# EAGLE design pqfb100-breakout (EAGLE 6.6.0)
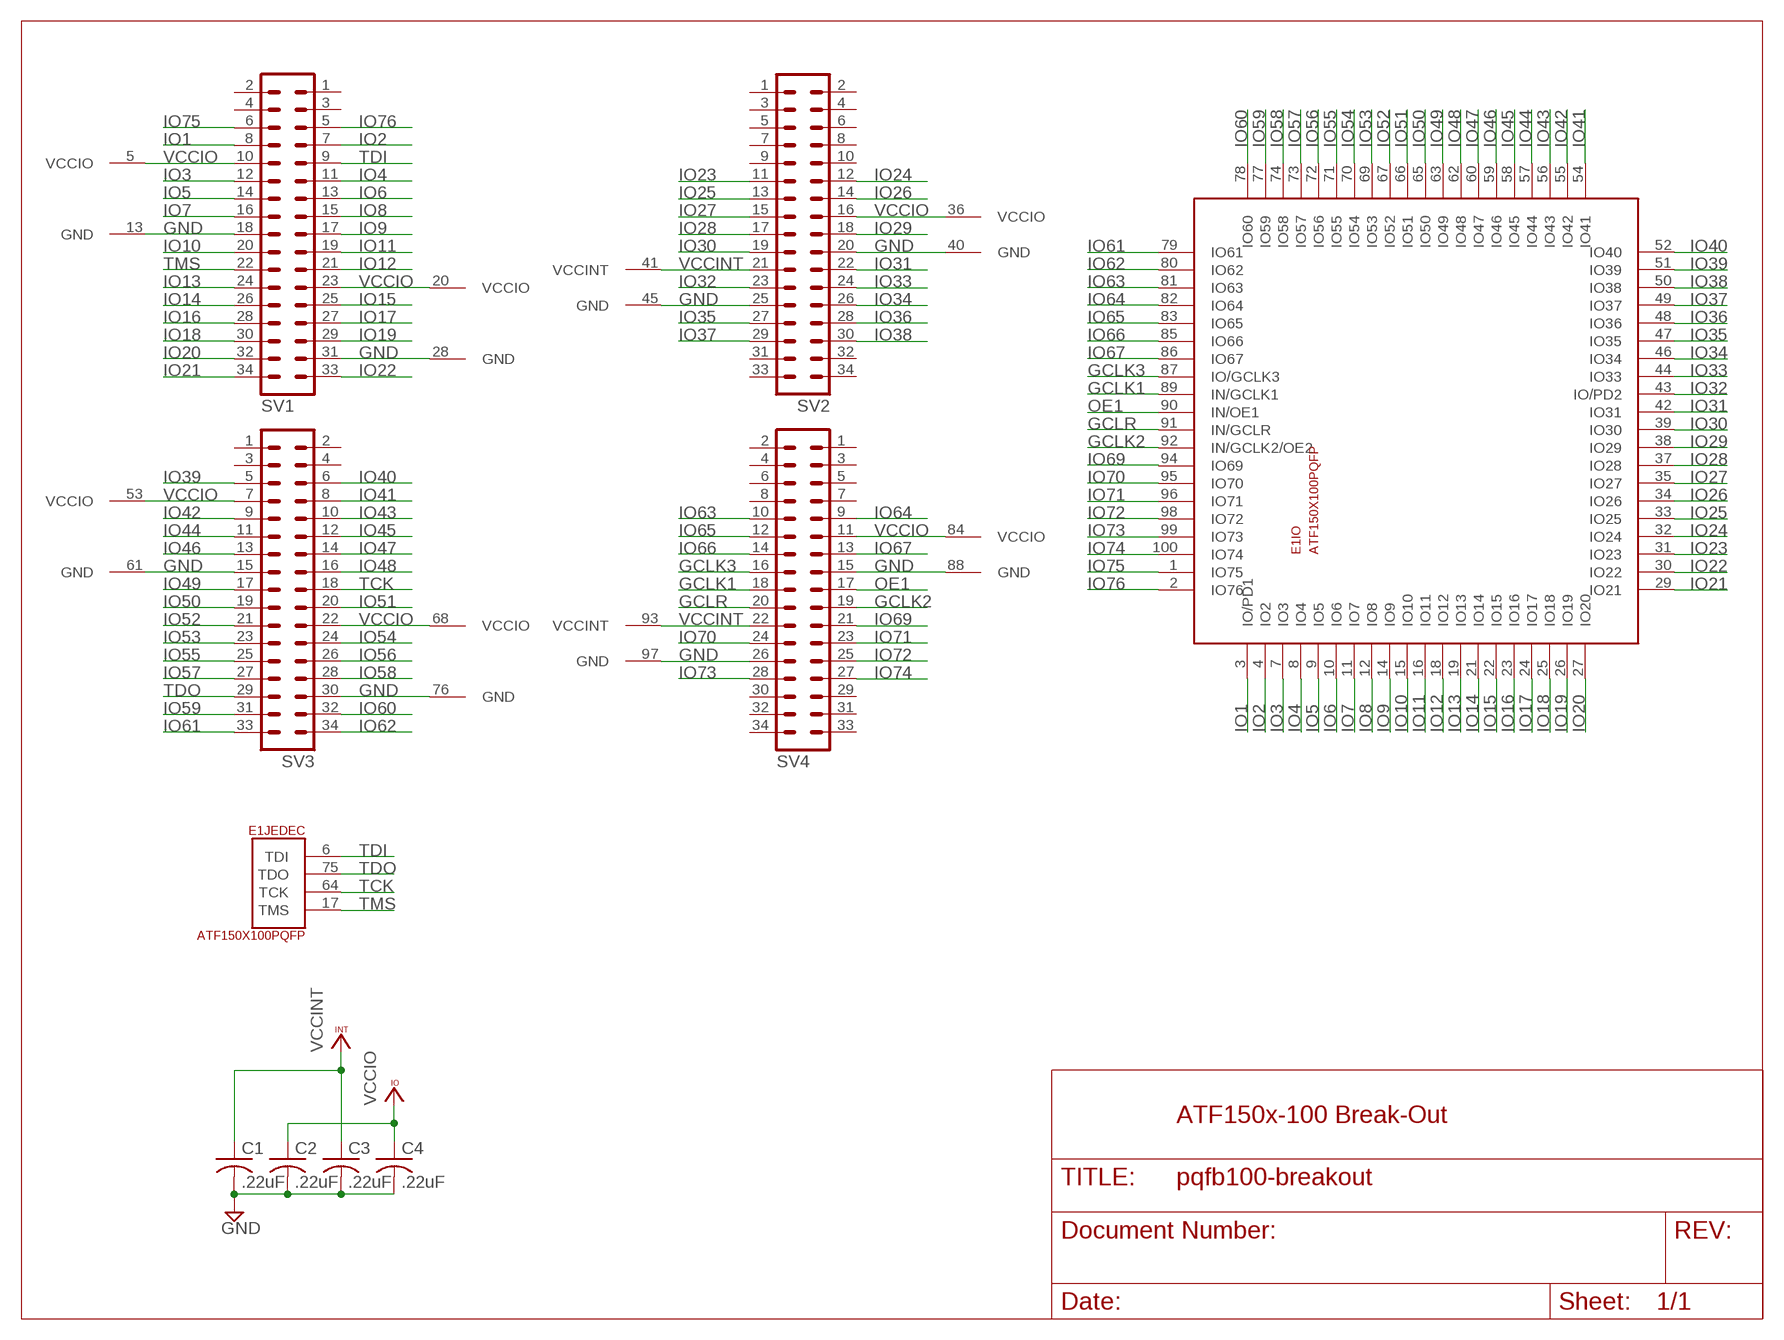
[diagram p0: schematic, sheet 1]

## Parts
C1  .22uF  C-US  [C063-025X075]
C2  .22uF  C-US  [C063-025X075]
C3  .22uF  C-US  [C063-025X075]
C4  .22uF  C-US  [C063-025X075]
E1  ATF150X100PQFP  [PQFP-100]
SV1  MA17-2  [MA17-2]
SV2  MA17-2  [MA17-2]
SV3  MA17-2  [MA17-2]
SV4  MA17-2  [MA17-2]

## Nets
GCLK1: E1.89(IO:IN/GCLK1) SV4.18
GCLK2: E1.92(IO:IN/GCLK2/OE2) SV4.19
GCLK3: E1.87(IO:IO/GCLK3) SV4.16
GCLR: E1.91(IO:IN/GCLR) SV4.20
GND [supply]: C1.2 C2.2 C3.2 C4.2 E1.13(GND) E1.28(GND) E1.40(GND) E1.45(GND) E1.61(GND) E1.76(GND) E1.88(GND) E1.97(GND) SV1.18 SV1.31 SV2.20 SV2.25 SV3.15 SV3.30 SV4.15 SV4.26
IO1: E1.3(IO:IO/PD1) SV1.8
IO2: E1.4(IO:IO2) SV1.7
IO3: E1.7(IO:IO3) SV1.12
IO4: E1.8(IO:IO4) SV1.11
IO5: E1.9(IO:IO5) SV1.14
IO6: E1.10(IO:IO6) SV1.13
IO7: E1.11(IO:IO7) SV1.16
IO8: E1.12(IO:IO8) SV1.15
IO9: E1.14(IO:IO9) SV1.17
IO10: E1.15(IO:IO10) SV1.20
IO11: E1.16(IO:IO11) SV1.19
IO12: E1.18(IO:IO12) SV1.21
IO13: E1.19(IO:IO13) SV1.24
IO14: E1.21(IO:IO14) SV1.26
IO15: E1.22(IO:IO15) SV1.25
IO16: E1.23(IO:IO16) SV1.28
IO17: E1.24(IO:IO17) SV1.27
IO18: E1.25(IO:IO18) SV1.30
IO19: E1.26(IO:IO19) SV1.29
IO20: E1.27(IO:IO20) SV1.32
IO21: E1.29(IO:IO21) SV1.34
IO22: E1.30(IO:IO22) SV1.33
IO23: E1.31(IO:IO23) SV2.11
IO24: E1.32(IO:IO24) SV2.12
IO25: E1.33(IO:IO25) SV2.13
IO26: E1.34(IO:IO26) SV2.14
IO27: E1.35(IO:IO27) SV2.15
IO28: E1.37(IO:IO28) SV2.17
IO29: E1.38(IO:IO29) SV2.18
IO30: E1.39(IO:IO30) SV2.19
IO31: E1.42(IO:IO31) SV2.22
IO32: E1.43(IO:IO/PD2) SV2.23
IO33: E1.44(IO:IO33) SV2.24
IO34: E1.46(IO:IO34) SV2.26
IO35: E1.47(IO:IO35) SV2.27
IO36: E1.48(IO:IO36) SV2.28
IO37: E1.49(IO:IO37) SV2.29
IO38: E1.50(IO:IO38) SV2.30
IO39: E1.51(IO:IO39) SV3.5
IO40: E1.52(IO:IO40) SV3.6
IO41: E1.54(IO:IO41) SV3.8
IO42: E1.55(IO:IO42) SV3.9
IO43: E1.56(IO:IO43) SV3.10
IO44: E1.57(IO:IO44) SV3.11
IO45: E1.58(IO:IO45) SV3.12
IO46: E1.59(IO:IO46) SV3.13
IO47: E1.60(IO:IO47) SV3.14
IO48: E1.62(IO:IO48) SV3.16
IO49: E1.63(IO:IO49) SV3.17
IO50: E1.65(IO:IO50) SV3.19
IO51: E1.66(IO:IO51) SV3.20
IO52: E1.67(IO:IO52) SV3.21
IO53: E1.69(IO:IO53) SV3.23
IO54: E1.70(IO:IO54) SV3.24
IO55: E1.71(IO:IO55) SV3.25
IO56: E1.72(IO:IO56) SV3.26
IO57: E1.73(IO:IO57) SV3.27
IO58: E1.74(IO:IO58) SV3.28
IO59: E1.77(IO:IO59) SV3.31
IO60: E1.78(IO:IO60) SV3.32
IO61: E1.79(IO:IO61) SV3.33
IO62: E1.80(IO:IO62) SV3.34
IO63: E1.81(IO:IO63) SV4.10
IO64: E1.82(IO:IO64) SV4.9
IO65: E1.83(IO:IO65) SV4.12
IO66: E1.85(IO:IO66) SV4.14
IO67: E1.86(IO:IO67) SV4.13
IO69: E1.94(IO:IO69) SV4.21
IO70: E1.95(IO:IO70) SV4.24
IO71: E1.96(IO:IO71) SV4.23
IO72: E1.98(IO:IO72) SV4.25
IO73: E1.99(IO:IO73) SV4.28
IO74: E1.100(IO:IO74) SV4.27
IO75: E1.1(IO:IO75) SV1.6
IO76: E1.2(IO:IO76) SV1.5
OE1: E1.90(IO:IN/OE1) SV4.17
TCK: E1.64(JEDEC:TCK) SV3.18
TDI: E1.6(JEDEC:TDI) SV1.9
TDO: E1.75(JEDEC:TDO) SV3.29
TMS: E1.17(JEDEC:TMS) SV1.22
VCCINT: C1.1 C3.1 E1.41(VCCINT) E1.93(VCCINT) SV2.21 SV4.22
VCCIO: C2.1 C4.1 E1.5(VCCIO) E1.20(VCCIO) E1.36(VCCIO) E1.53(VCCIO) E1.68(VCCIO) E1.84(VCCIO) SV1.10 SV1.23 SV2.16 SV3.7 SV3.22 SV4.11
Unconnected: SV1.1 SV1.2 SV1.3 SV1.4 SV2.1 SV2.2 SV2.3 SV2.4 SV2.5 SV2.6 SV2.7 SV2.8 SV2.9 SV2.10 SV2.31 SV2.32 SV2.33 SV2.34 SV3.1 SV3.2 SV3.3 SV3.4 SV4.1 SV4.2 SV4.3 SV4.4 SV4.5 SV4.6 SV4.7 SV4.8 SV4.29 SV4.30 SV4.31 SV4.32 SV4.33 SV4.34

## Notes on the sheet
- ATF150x-100 Break-Out

## Library data of the parts
C1-C4 = dec-con:C-US: Capacitors with funky DEC lead spacing.
E1 = atmel-cpld:ATF150X100: ATF150x in 100 pin package.
SV1-SV4 = con-lstb:MA17-2: PIN HEADER; OC_FARNELL: unknown; OC_NEWARK: unknown

## Net classes
0 default: width 0.381 mm
1 supply: width 0.381 mm

## Board
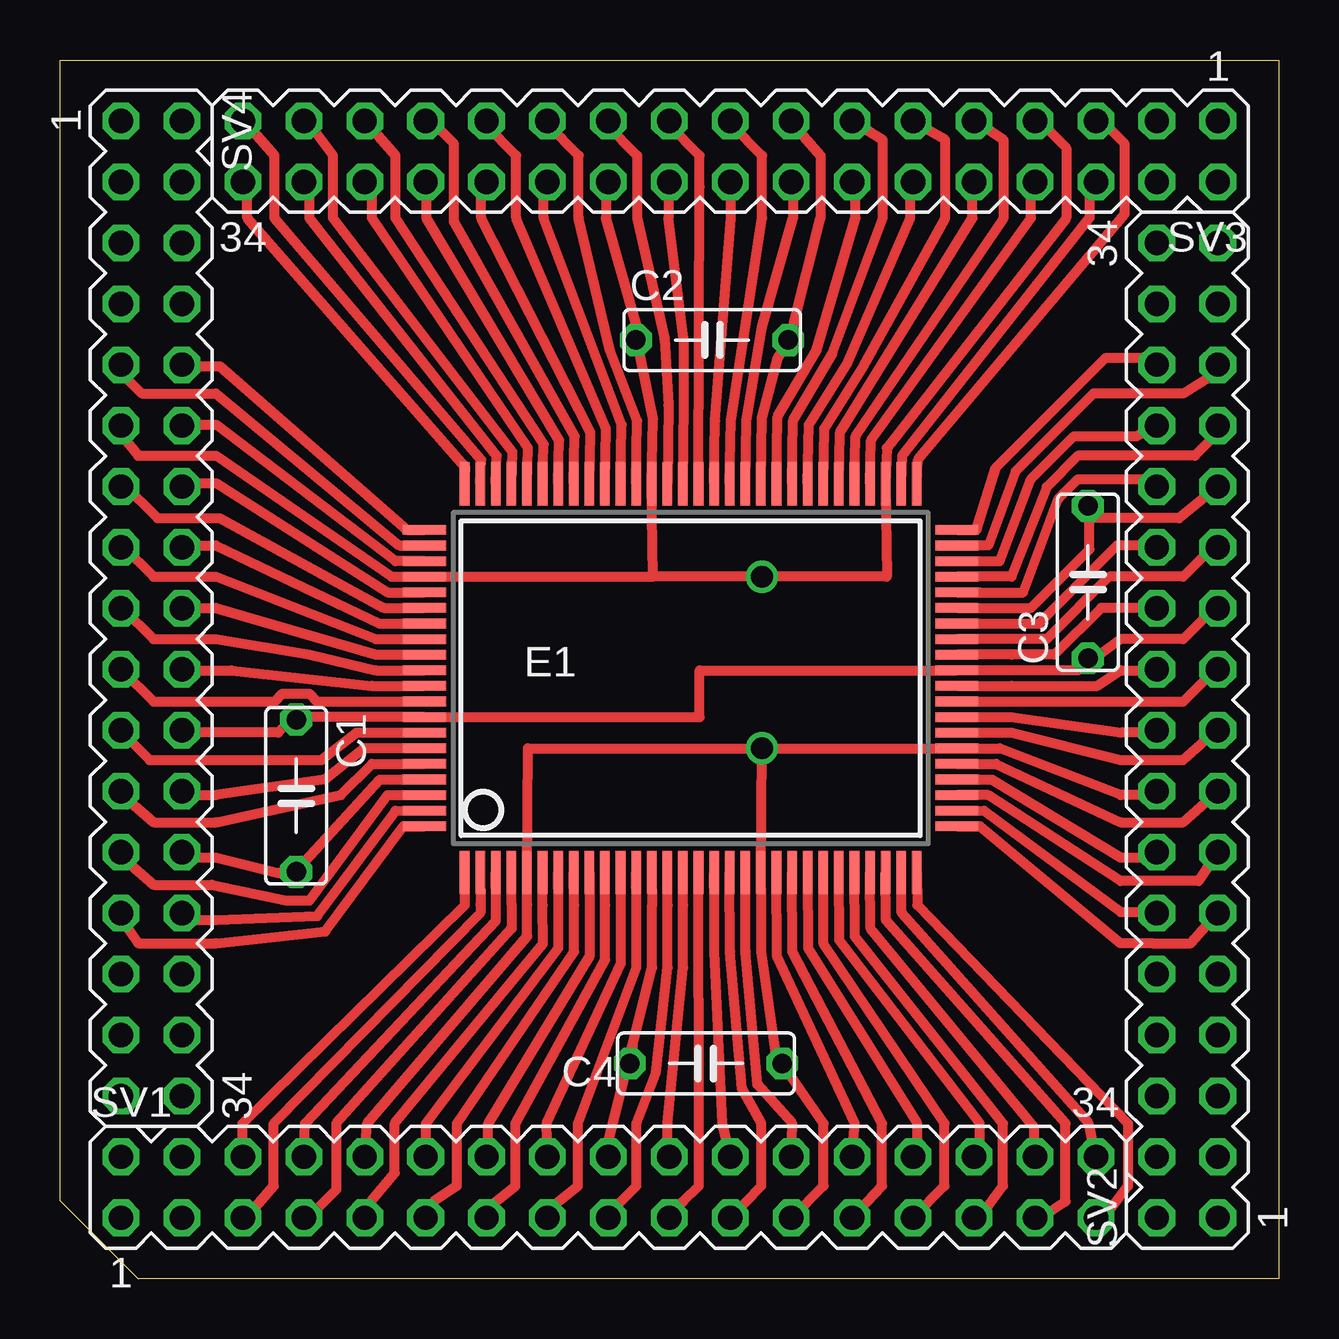
[diagram p1: board, top side]
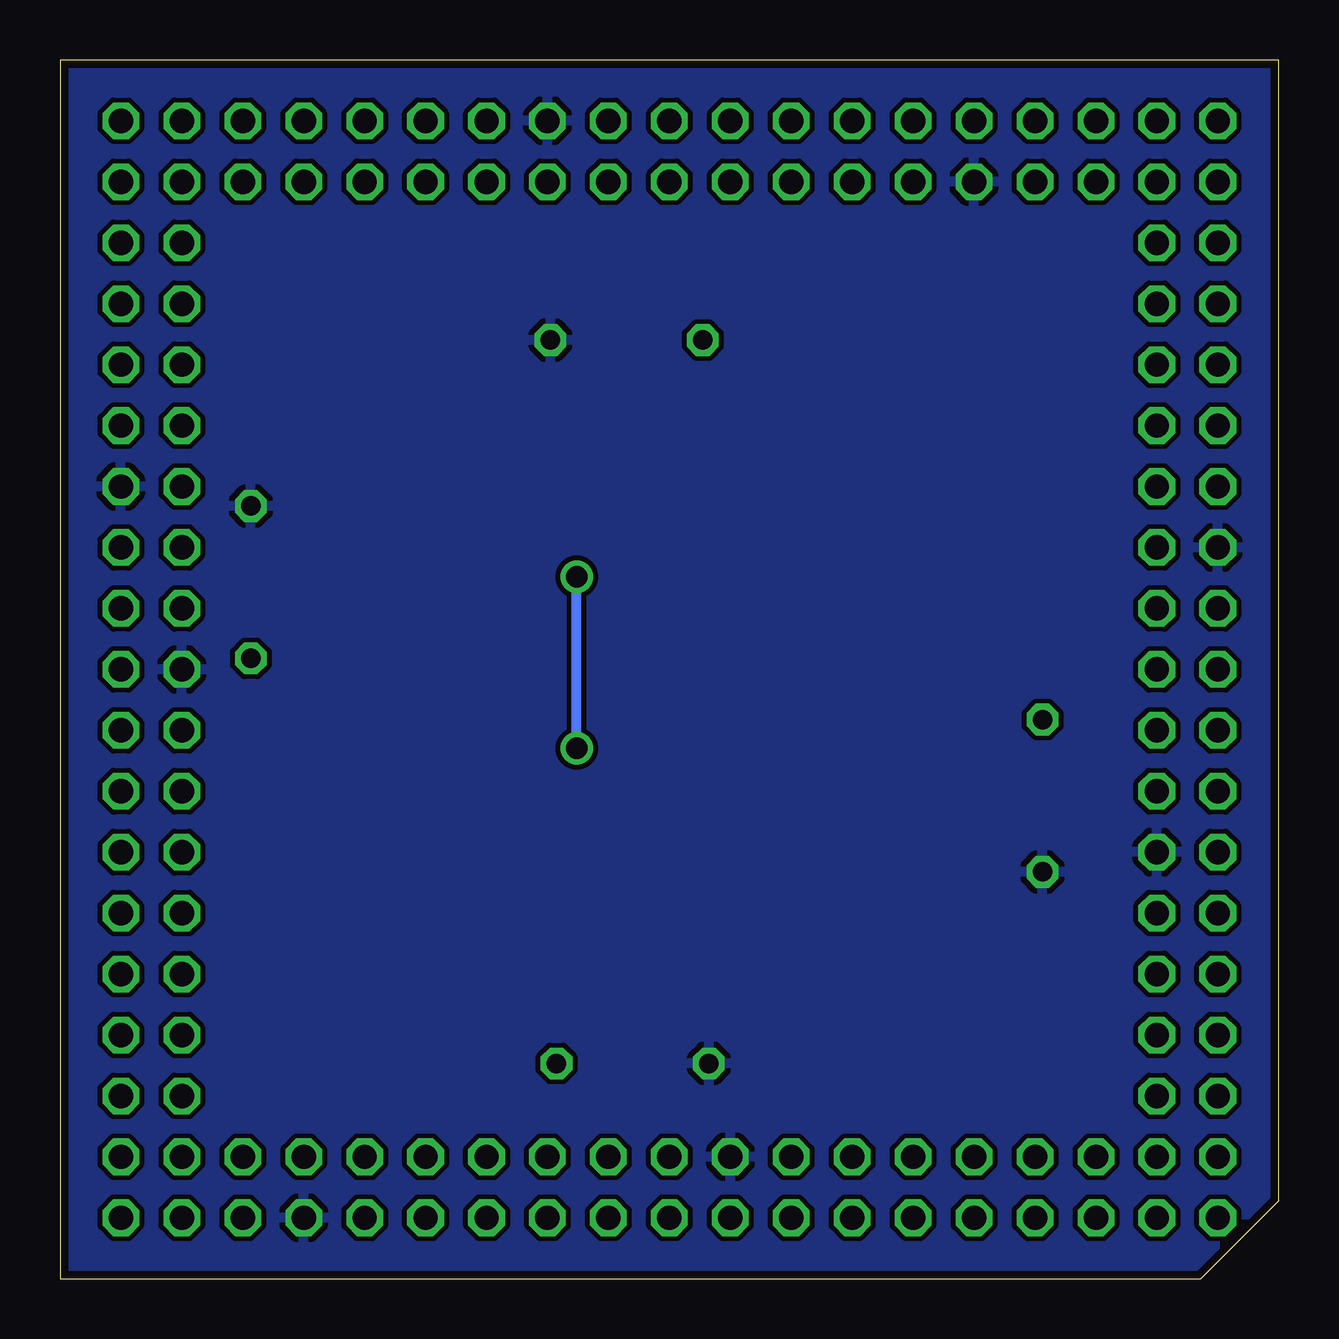
[diagram p2: board, bottom side, seen from below]

Size 50.8 x 50.8 mm. Coordinates in mm from the lower left corner, seen from the top.
Outline: 0,3.25 0,50.8 50.8,50.8 50.8,0 3.25,0 0,3.25
Copper layers (1+16): Top 0.035mm / dielectric 1.5mm / Bottom 0.035mm
Design rules "16mils *": minimum track width 15mil, minimum drill 32mil, track to track 8mil, track to pad 8mil, pad to pad 9mil, via to via 10mil, smd to smd 7mil, copper to edge 13mil, drill to drill 10mil, minimum pad ring 10mil, minimum via ring 8mil, stop-mask expansion 0mil, vias tented up to drill 0mil, thermal gap 10mil

### Footprints (pad centres in the part's own frame; a part is rotated, then mirrored left to right if it is on the bottom)
C063-025X075 = drill 0.813 octagon: 1 -2.54,0; 2 3.81,0
PQFP-100 = smd 0.4 x 1.8: 1 -9.425,-8.1; 2 -8.775,-8.1; 3 -8.125,-8.1; 4 -7.475,-8.1; 5 -6.825,-8.1; 6 -6.175,-8.1; 7 -5.525,-8.1; 8 -4.875,-8.1; 9 -4.225,-8.1; 10 -3.575,-8.1; 11 -2.925,-8.1; 12 -2.275,-8.1; 13 -1.625,-8.1; 14 -0.975,-8.1; 15 -0.325,-8.1; 16 0.325,-8.1; 17 0.975,-8.1; 18 1.625,-8.1; 19 2.275,-8.1; 20 2.925,-8.1; 21 3.575,-8.1; 22 4.225,-8.1; 23 4.875,-8.1; 24 5.525,-8.1; 25 6.175,-8.1; 26 6.825,-8.1; 27 7.475,-8.1; 28 8.125,-8.1; 29 8.775,-8.1; 30 9.425,-8.1; 51 9.425,8.1; 52 8.775,8.1; 53 8.125,8.1; 54 7.475,8.1; 55 6.825,8.1; 56 6.175,8.1; 57 5.525,8.1; 58 4.875,8.1; 59 4.225,8.1; 60 3.575,8.1; 61 2.925,8.1; 62 2.275,8.1; 63 1.625,8.1; 64 0.975,8.1; 65 0.325,8.1; 66 -0.325,8.1; 67 -0.975,8.1; 68 -1.625,8.1; 69 -2.275,8.1; 70 -2.925,8.1; 71 -3.575,8.1; 72 -4.225,8.1; 73 -4.875,8.1; 74 -5.525,8.1; 75 -6.175,8.1; 76 -6.825,8.1; 77 -7.475,8.1; 78 -8.125,8.1; 79 -8.775,8.1; 80 -9.425,8.1 | smd 1.8 x 0.4: 31 11.1,-6.175; 32 11.1,-5.525; 33 11.1,-4.875; 34 11.1,-4.225; 35 11.1,-3.575; 36 11.1,-2.925; 37 11.1,-2.275; 38 11.1,-1.625; 39 11.1,-0.975; 40 11.1,-0.325; 41 11.1,0.325; 42 11.1,0.975; 43 11.1,1.625; 44 11.1,2.275; 45 11.1,2.925; 46 11.1,3.575; 47 11.1,4.225; 48 11.1,4.875; 49 11.1,5.525; 50 11.1,6.175; 81 -11.1,6.175; 82 -11.1,5.525; 83 -11.1,4.875; 84 -11.1,4.225; 85 -11.1,3.575; 86 -11.1,2.925; 87 -11.1,2.275; 88 -11.1,1.625; 89 -11.1,0.975; 90 -11.1,0.325; 91 -11.1,-0.325; 92 -11.1,-0.975; 93 -11.1,-1.625; 94 -11.1,-2.275; 95 -11.1,-2.925; 96 -11.1,-3.575; 97 -11.1,-4.225; 98 -11.1,-4.875; 99 -11.1,-5.525; 100 -11.1,-6.175
MA17-2 = drill 1.016 octagon: 1 -20.32,-1.27; 2 -20.32,1.27; 3 -17.78,-1.27; 4 -17.78,1.27; 5 -15.24,-1.27; 6 -15.24,1.27; 7 -12.7,-1.27; 8 -12.7,1.27; 9 -10.16,-1.27; 10 -10.16,1.27; 11 -7.62,-1.27; 12 -7.62,1.27; 13 -5.08,-1.27; 14 -5.08,1.27; 15 -2.54,-1.27; 16 -2.54,1.27; 17 0,-1.27; 18 0,1.27; 19 2.54,-1.27; 20 2.54,1.27; 21 5.08,-1.27; 22 5.08,1.27; 23 7.62,-1.27; 24 7.62,1.27; 25 10.16,-1.27; 26 10.16,1.27; 27 12.7,-1.27; 28 12.7,1.27; 29 15.24,-1.27; 30 15.24,1.27; 31 17.78,-1.27; 32 17.78,1.27; 33 20.32,-1.27; 34 20.32,1.27

### Placement (x,y rotation side)
C1  9.85,20.77 270 top
C2  26.55,39.13 0 top
C3  42.84,28.4 90 top
C4  27.56,8.97 180 top
E1  26.29,25.03 0 top
SV1  22.86,3.81 0 top
SV2  46.99,22.86 90 top
SV3  27.94,46.99 180 top
SV4  3.81,27.94 270 top

### Tracks (layer width: path | path; a pad name or v marks a point on that pad's centre or on a via)
GCLK1
  Top 0.406: SV4.18 5.2,27.96 6.5,27.96 13.17,26.01 E1.89
GCLK2
  Top 0.406: SV4.19 2.6,25.36 3.9,24.06 8.94,24.06 9.27,24.38 10.4,24.38 10.73,24.06 E1.92
GCLK3
  Top 0.406: SV4.16 5.2,30.56 6.5,30.56 13.33,27.31 E1.87
GCLR
  Top 0.406: SV4.20 5.2,25.36 7.15,25.36 13.01,24.71 E1.91
GND
  Top 0.406: E1.13 24.68,15.57 24.68,12.97 23.87,9.72 | SV1.18 22.73,5.17 23.87,9.72 | 23.87,9.72 C4.2 | SV1.31 40.94,2.57 41.91,3.22 41.91,6.47 34.43,14.93 E1.28 | E1.40 39.66,24.71 43.24,24.71 44.22,25.36 45.52,25.36 SV2.20 | SV2.25 46.66,31.7 | 46.66,31.7 | 46.66,31.7 42.92,31.7 | E1.45 40.48,27.96 42.92,30.4 42.92,31.7 | 42.92,31.7 C3.2 | E1.61 29.26,35.93 29.91,38.36 C2.2 30.56,39.66 31.7,44.22 31.7,46.82 30.56,48.12 SV3.15 | E1.76 19.51,34.62 13.01,44.22 13.01,45.52 SV3.30 | SV4.26 5.2,17.56 6.5,17.56 9.1,16.91 9.75,16.91 | C1.2 9.75,16.91 | 9.75,16.91 13.33,20.81 E1.97 | SV4.15 2.6,30.56 3.9,29.26 6.5,29.26 13.17,26.66 E1.88
  pour Bottom: 3.25,0 0,3.25 0,50.72 50.72,50.72 50.72,0
IO1
  Top 0.406: E1.3 18.18,15.59 18.18,14.93 10.21,6.47 SV1.8
IO2
  Top 0.406: E1.4 18.83,15.59 18.83,15.57 18.83,14.6 11.51,6.47 11.51,3.71 10.37,2.57 SV1.7
IO3
  Top 0.406: E1.7 20.78,15.57 20.78,13.79 15.25,6.47 SV1.12
IO4
  Top 0.406: E1.8 21.43,15.57 21.43,13.62 16.55,6.47 16.55,3.87 15.57,3.22 SV1.11
IO5
  Top 0.406: E1.9 22.08,15.57 22.08,13.46 17.85,6.47 17.85,5.17 SV1.14
IO6
  Top 0.406: SV1.13 18.18,3.22 18.99,3.87 18.99,6.47 22.73,13.3 22.73,15.57 E1.10
IO7
  Top 0.406: SV1.16 20.29,6.47 23.38,13.14 23.38,15.57 E1.11
IO8
  Top 0.406: SV1.15 20.78,3.22 21.59,3.87 21.59,6.47 24.03,12.97 24.03,15.57 E1.12
IO9
  Top 0.406: SV1.17 23.38,3.22 24.03,3.87 24.03,6.47 24.84,8.59 25.33,12.97 25.33,15.57 E1.14
IO10
  Top 0.406: SV1.20 25.33,5.17 25.33,6.47 25.98,12.97 25.98,15.57 E1.15
IO11
  Top 0.406: SV1.19 25.98,3.22 26.63,3.87 26.63,6.47 E1.16
IO12
  Top 0.406: SV1.21 29.23,3.87 29.23,6.47 28.42,7.93 27.93,13.62 E1.18
IO13
  Top 0.406: SV1.24 30.53,6.47 29.07,8.1 28.58,13.62 E1.19
IO14
  Top 0.406: SV1.26 33.13,6.47 29.88,13.46 E1.21
IO15
  Top 0.406: SV1.25 34.27,3.87 34.27,6.47 30.53,13.62 E1.22
IO16
  Top 0.406: E1.23 31.18,13.79 35.73,6.47 35.73,5.17 SV1.28
IO17
  Top 0.406: SV1.27 36.87,3.87 36.87,6.47 31.83,13.95 E1.24
IO18
  Top 0.406: SV1.30 38.33,5.82 38.33,6.47 32.48,14.11 E1.25
IO19
  Top 0.406: SV1.29 38.33,2.57 39.31,3.87 39.31,6.47 33.13,14.28 E1.26
IO20
  Top 0.406: SV1.32 40.61,6.31 33.78,14.6 E1.27
IO21
  Top 0.406: SV1.34 42.88,6.47 35.08,15.25 E1.29
IO22
  Top 0.406: E1.30 35.73,15.57 44.51,6.47 44.51,3.87 43.54,2.57 SV1.33
IO23
  Top 0.406: E1.31 38.36,18.86 44.22,13.98 45.52,13.98 47.14,13.98 SV2.11
IO24
  Top 0.406: E1.32 38.53,19.51 44.22,15.28 45.52,15.28 SV2.12
IO25
  Top 0.406: SV2.13 48.12,17.56 47.47,16.58 44.22,16.58 38.69,20.16 E1.33
IO26
  Top 0.406: E1.34 38.85,20.81 44.22,17.56 45.52,17.56 SV2.14
IO27
  Top 0.406: E1.35 39.01,21.46 44.22,19.02 46.82,19.02 48.12,20.16 SV2.15
IO28
  Top 0.406: E1.37 39.66,22.76 44.22,21.62 46.82,21.62 48.12,22.76 SV2.17
IO29
  Top 0.406: E1.38 39.66,23.41 44.22,22.76 45.52,22.76 SV2.18
IO30
  Top 0.406: E1.39 46.82,24.06 48.12,25.36 SV2.19
IO31
  Top 0.406: SV2.22 45.52,27.96 43.4,27.96 41.45,26.01 39.66,26.01 E1.42
IO32
  Top 0.406: SV2.23 48.12,30.56 46.82,29.26 43.73,29.26 41.13,26.66 E1.43
IO33
  Top 0.406: E1.44 40.8,27.31 44.05,30.56 45.52,30.56 SV2.24
IO34
  Top 0.406: E1.46 38.36,28.61 40.15,28.61 41.62,32.51 42.43,33.33 45.52,33.33 SV2.26
IO35
  Top 0.406: SV2.27 48.12,35.11 47.3,34.3 42.43,34.3 41.13,33 39.66,29.26 E1.47
IO36
  Top 0.406: E1.48 39.18,29.91 40.48,33.33 42.27,35.11 44.87,35.11 SV2.28
IO37
  Top 0.406: SV2.29 48.12,37.71 46.82,36.9 43.08,36.9 39.83,33.65 38.69,30.56 E1.49
IO38
  Top 0.406: SV2.30 45.52,38.36 43.57,38.36 39.01,33.81 38.2,31.21 37.71,31.21 E1.50
IO39
  Top 0.406: E1.51 35.76,34.14 44.38,44.38 44.38,47.3 43.57,48.12 SV3.5
IO40
  Top 0.406: E1.52 35.11,34.3 42.92,44.22 42.92,45.52 SV3.6
IO41
  Top 0.406: E1.54 33.81,34.95 40.48,44.22 40.48,45.52 SV3.8
IO42
  Top 0.406: E1.55 33.16,35.11 39.34,44.22 39.34,47.47 38.36,48.12 SV3.9
IO43
  Top 0.406: E1.56 32.51,35.28 38.04,44.22 38.04,45.52 SV3.10
IO44
  Top 0.406: E1.57 31.86,35.44 33.49,38.04 36.9,44.22 36.9,47.47 35.76,48.12 SV3.11
IO45
  Top 0.406: E1.58 31.21,35.6 32.84,38.2 35.44,44.22 35.44,45.52 SV3.12
IO46
  Top 0.406: E1.59 30.56,35.76 32.19,38.53 34.3,44.22 34.3,47.47 SV3.13
IO47
  Top 0.406: E1.60 29.91,35.93 31.54,38.69 33.16,44.22 33.16,45.52 SV3.14
IO48
  Top 0.406: E1.62 28.61,35.76 29.26,39.66 30.56,44.22 30.56,45.52 SV3.16
IO49
  Top 0.406: E1.63 27.96,35.76 29.26,44.22 29.26,46.82 27.96,48.12 SV3.17
IO50
  Top 0.406: E1.65 26.66,45.52 26.66,46.82 25.36,48.12 SV3.19
IO51
  Top 0.406: E1.66 26.01,36.41 26.01,39.01 25.36,44.22 25.36,45.52 SV3.20
IO52
  Top 0.406: SV3.21 22.76,48.12 24.06,46.82 24.06,44.22 25.2,39.18 25.36,36.41 E1.67
IO53
  Top 0.406: E1.69 24.06,35.76 22.92,38.69 21.62,44.22 21.62,46.82 20.32,48.12 SV3.23
IO54
  Top 0.406: E1.70 23.41,35.6 20.16,44.22 20.16,45.52 SV3.24
IO55
  Top 0.406: E1.71 22.76,35.44 19.02,44.22 19.02,46.82 17.72,48.12 SV3.25
IO56
  Top 0.406: E1.72 22.11,35.28 17.56,44.22 17.56,45.52 SV3.26
IO57
  Top 0.406: E1.73 21.46,35.11 16.42,44.05 16.42,47.3 15.61,48.12 SV3.27
IO58
  Top 0.406: E1.74 20.81,34.95 15.28,44.22 15.28,45.52 SV3.28
IO59
  Top 0.406: E1.77 18.86,34.46 11.38,44.22 11.38,46.82 10.4,48.12 SV3.31
IO60
  Top 0.406: E1.78 18.21,34.3 10.4,44.22 10.4,45.52 SV3.32
IO61
  Top 0.406: E1.79 17.56,34.14 8.94,44.22 8.94,46.82 7.8,48.12 SV3.33
IO62
  Top 0.406: E1.80 16.91,33.81 7.8,44.22 7.8,45.52 SV3.34
IO63
  Top 0.406: SV4.10 5.36,38.04 6.67,38.04 14.47,31.21 E1.81
IO64
  Top 0.406: SV4.9 2.6,37.71 3.41,36.9 6.5,36.9 14.14,30.56 E1.82
IO65
  Top 0.406: E1.83 13.98,29.91 6.5,35.6 5.2,35.6 SV4.12
IO66
  Top 0.406: SV4.14 5.2,33.16 6.5,33.16 13.65,28.61 E1.85
IO67
  Top 0.406: SV4.13 2.6,33.16 4.06,31.7 6.67,31.7 13.49,27.96 E1.86
IO69
  Top 0.406: SV4.21 2.6,22.76 3.74,21.62 10.89,21.62 12.36,22.76 E1.94
IO70
  Top 0.406: E1.95 13.01,22.11 12.68,22.11 11.05,20.81 6.5,20.16 5.2,20.16 SV4.24
IO71
  Top 0.406: SV4.23 2.6,20.16 3.9,19.02 6.5,19.02 11.7,20.16 13.01,21.46 E1.96
IO72
  Top 0.406: SV4.25 2.6,17.56 3.9,16.42 6.34,16.42 9.43,15.77 10.4,15.77 13.65,20.16 E1.98
IO73
  Top 0.406: SV4.28 5.2,14.96 6.5,14.96 10.73,15.12 13.98,19.51 E1.99
IO74
  Top 0.406: SV4.27 2.6,14.96 3.25,13.98 6.5,13.98 11.05,14.47 14.3,18.86 E1.100
IO75
  Top 0.406: 16.88,15.57 7.61,6.47 SV1.6 | 16.88,15.57 arc0 16.88,15.57 | 16.88,15.57 E1.1
IO76
  Top 0.406: E1.2 17.53,15.6 17.53,15.25 8.91,6.47 8.91,3.87 7.77,2.57 SV1.5
OE1
  Top 0.406: SV4.17 2.6,27.96 3.9,26.66 6.5,26.66 10.4,26.01 13.17,25.36 E1.90
TCK
  Top 0.406: E1.64 27.31,35.76 27.96,44.22 SV3.18
TDI
  Top 0.406: 13.95,6.47 13.95,4.4 12.97,3.22 SV1.9 | 13.95,6.47 | 13.95,6.47 20.13,13.95 20.12,15.57 E1.6
TDO
  Top 0.406: E1.75 20.16,34.79 13.98,44.22 13.98,46.82 12.84,48.12 SV3.29
TMS
  Top 0.406: SV1.22 27.61,6.47 27.28,13.62 27.28,15.57 E1.17
VCCINT
  Top 0.406: SV2.21 48.12,27.96 46.82,26.66 44.22,26.66 42.75,25.59 | 42.75,25.59 42.43,25.36 39.66,25.36 E1.41 26.66,25.36 26.66,23.41 E1.93 10.4,23.41 C1.1 9.75,23.41 9.1,22.76 5.2,22.76 SV4.22 | C3.1 42.75,25.59
VCCIO  (via drill 0.9 pad 0.3)
  Top 0.406: SV1.10 12.81,6.47 19.48,14.28 19.48,15.59 E1.5 19.51,22.11 v29.26,22.11 | SV1.23 30.53,2.57 31.83,3.87 31.83,6.47 C4.1 29.88,9.07 29.23,13.62 29.23,15.57 E1.20 v29.26,22.11 | SV2.16 45.52,20.16 44.22,20.16 39.18,22.11 E1.36 v29.26,22.11 | SV3.7 40.97,48.12 41.94,47.14 41.94,44.22 34.46,34.62 E1.53 34.46,29.26 v29.26,29.26 24.71,29.26 | SV3.22 22.76,45.52 22.76,44.22 24.06,39.66 C2.1 24.06,39.01 24.71,35.76 E1.68 24.71,29.26 | SV4.11 2.6,35.11 3.25,34.3 6.5,34.3 13.82,29.26 14.3,29.26 E1.84 24.71,29.26
  Bottom 0.406: v29.26,22.11 v29.26,29.26